# Altium schematic sheet LDO_4V3.SchDoc
size A4; SheetNumber: 7; SheetTotal: 8; SPICEModelCacheGQKPAAKM: <root> / <DocumentId>GQKPAAKM</DocumentId> / <CacheFrame Number="0"> / <Model Name="cap" Kind="MDL"> / <Text>*Default semiconductor capacitor / .MODEL CAP C()</Text> / </Model> / <Model Name="res" Kind="MDL"> / <Text>*Default semiconductor resistor / .MODEL RES R()</Text> / </Model> / </CacheFrame> / </root>
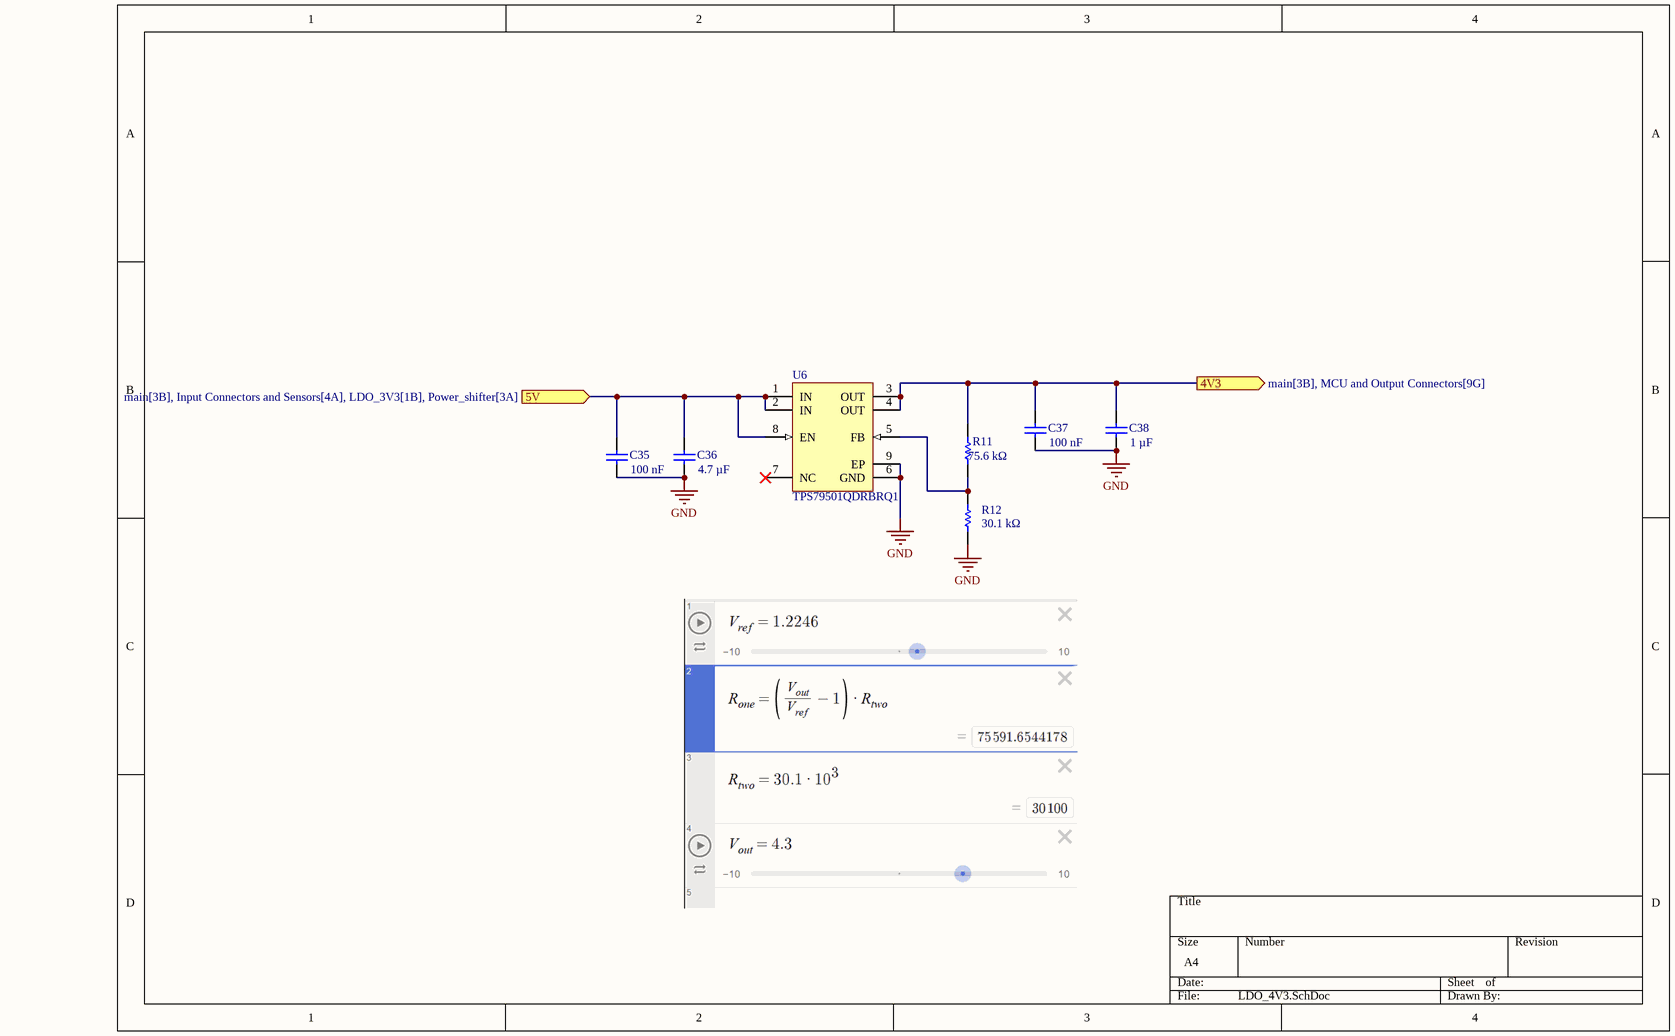
[diagram p0: LDO_4V3.SchDoc]

## Parts
C35  value 100 nF  [0402_CAPC1005L]  (hidden comment: Cap Semi)
C36  value 4.7 µF  [0805_CAPC2012L]  (hidden comment: Cap Semi)
C37  value 100 nF  [0402_CAPC1005L]  (hidden comment: Cap Semi)
C38  value 1 µF  [0805_CAPC2012L]  (hidden comment: Cap Semi)
R11  value 75.6 kΩ  [0402_RESC1005L]  (hidden comment: Res Semi)
R12  value 30.1 kΩ  [0402_RESC1005L]  (hidden comment: Res Semi)
U6  TPS79501QDRBRQ1  [DRB0008B_V]

## Ports
4V3 (out, see main[3B], MCU and Output Connectors[9G]), 5V (in, see main[3B], Input Connectors and Sensors[4A], LDO_3V3[1B], Power_shifter[3A])

## Nets
GND: C35.1 C36.1 C37.1 C38.1 R12.1 U6.6(GND) U6.9(EP)
4V3: C37.2 C38.2 R11.2 U6.3(OUT) U6.4(OUT) ; port 4V3
5V: C35.2 C36.2 U6.1(IN) U6.2(IN) U6.8(EN) ; port 5V
NetR11_1: R11.1 R12.2 U6.5(FB)

Not connected (* = marked no-connect by the designer): U6 7(NC)*

## Library data of the parts
C35-C38 = Cap Semi: Capacitor (Semiconductor SIM Model); Published: 8-Jun-2000; LatestRevisionDate: 29-May-2009; LatestRevisionNote: IPC-7351 Footprint Added.; PackageReference: C1206; Publisher: Altium Limited; PackageDescription: Chip Capacitor; Digikey part#: *; Manufacturer: *; Manufacturer part#: *
R11 R12 = Res Semi: Semiconductor Resistor; Published: 8-Jun-2000; LatestRevisionDate: 17-Jul-2002; LatestRevisionNote: Re-released for DXP Platform.; PackageReference: AXIAL-0.5; Publisher: Altium Limited; Digikey part#: *; Manufacturer: *; Manufacturer part#: *
U6 = CMP-0395-00646-2: Single Output High PSRR LDO, 500 mA, Adjustable 1.2 to 5.5 V Output, 2.7 to 5.5 V Input, 8-pin SON (DRB), -40 to 125 degC, Green (RoHS & no Sb/Br); Manufacturer: Texas Instruments; Vout Adj(Max)(V): 5.5; Iout(Max)(A): 0.5; Vdo(Typ)(mV): 110; Accuracy(%): 2; SubFamily: Single Channel LDO; Vout Adj(Min)(V): 1.2; Vin(Min)(V): 2.7; Iq(Typ)(mA): 0.26; Rating: Automotive; ComponentLink3URL: http://www.ti.com/litv/pdf/mpds118h; DatasheetVersion: SLVSAJ9; Vin(Max)(V): 5.5; Mounting Technology: Surface Mount; ComponentLink1Description: Manufacturer URL; ComponentLink1URL: http://www.ti.com/; Eco-Plan: Green (RoHS & no Sb/Br); ComponentLink2URL: http://www.ti.com/general/docs/lit/getliterature.tsp?genericPartNumber=TPS79501-Q1&fileType=pdf; PartNumber: TPS79501QDRBRQ1; PackageVersion: 4203482-2/K; PackageReference: DRB0008B; PackageDescription: 8-Pin Plastic Small Outline, Body 3 x 3 mm, Pitch 0.65 mm; ComponentLink2Description: Datasheet; ComponentLink3Description: Package Specification